# EAGLE design v1_TH (EAGLE 6.6.0)
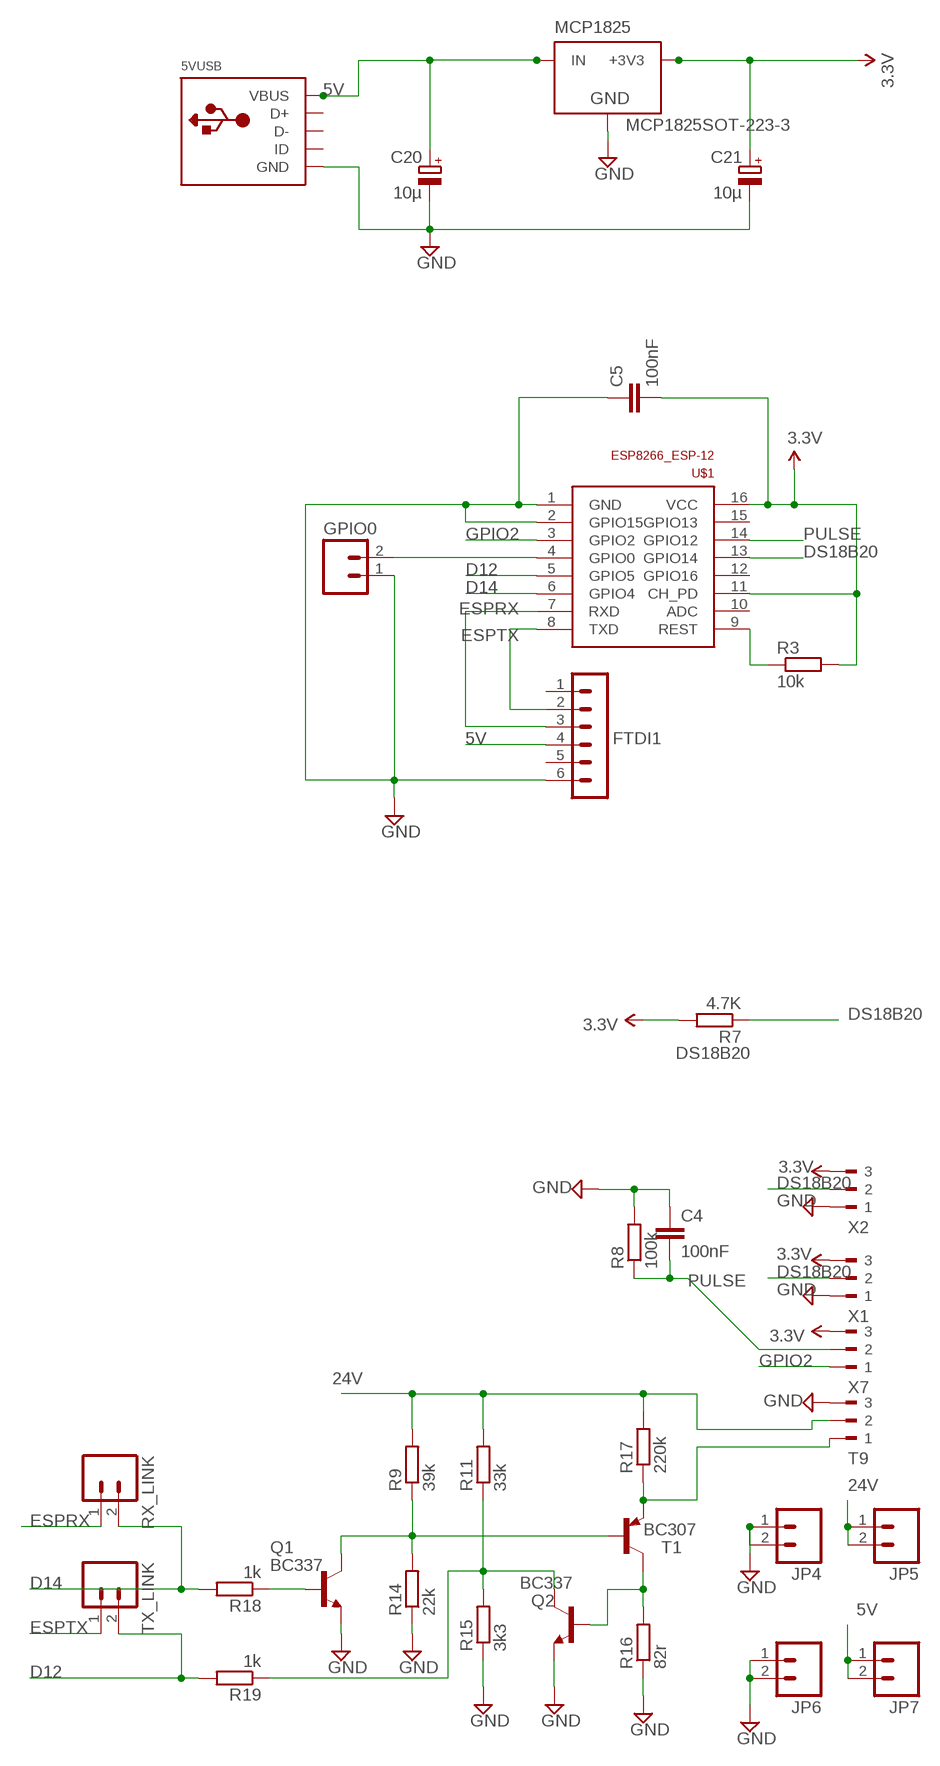
[diagram p0: schematic, sheet 1]

## Parts
5VUSB  USBMOLEX  [USB-MINIB-THM-MOLEX]
C4  100nF  C-EU025-024X044  [C025-024X044]
C5  100nF  C-EU025-024X044  [C025-024X044]
C20  10µ  CPOL-EUE1.8-4  [E1,8-4]
C21  10µ  CPOL-EUE1.8-4  [E1,8-4]
FTDI1  FTDI  MA06-1  [MA06-1]
GPIO0  M02PTH  [1X02]
JP4  M02PTH  [1X02]
JP5  M02PTH  [1X02]
JP6  M02PTH  [1X02]
JP7  M02PTH  [1X02]
MCP1825  MCP1825SOT-223-3  [SOT-223]
Q1  BC337  [TO92]
Q2  BC337  [TO92]
R3  10k  R-EU_0204/7  [0204/7]
R7  4.7K  R-EU_0204/7  [0204/7]
R8  100k  R-EU_0207/2V  [0207/2V]
R9  39k  R-EU_0204/7  [0204/7]
R11  33k  R-EU_0204/7  [0204/7]
R14  22k  R-EU_0204/7  [0204/7]
R15  3k3  R-EU_0204/7  [0204/7]
R16  82r  R-EU_0204/7  [0204/7]
R17  220k  R-EU_0204/7  [0204/7]
R18  1k  R-EU_0204/7  [0204/7]
R19  1k  R-EU_0204/7  [0204/7]
RX_LINK  M02PTH  [1X02]
T1  BC307  [TO92]
T9  180-3  [180-3]
TX_LINK  M02PTH  [1X02]
U$1  ESP8266_ESP-12  [ESP8266-ESP12]
X1  180-3  [180-3]
X2  180-3  [180-3]
X7  180-3  [180-3]

## Nets
3.3V: C5.2 C21.+ MCP1825.3(+3V3) R3.2 R7.2 U$1.11(CH_PD) U$1.16(VCC) X1.3 X2.3 X7.3
5V [power]: 5VUSB.VBUS C20.+ FTDI1.4 JP7.1 JP7.2 MCP1825.1(IN)
24V: JP5.1 JP5.2 R9.2 R11.2 R17.2 T9.2
D12: R19.2 TX_LINK.2 U$1.5(GPIO5)
D14: R18.2 RX_LINK.2 U$1.6(GPIO4)
DS18B20: R7.1 U$1.13(GPIO14) X1.2 X2.2
ESPRX: FTDI1.3 RX_LINK.1 U$1.7(RXD)
ESPTX: FTDI1.2 TX_LINK.1 U$1.8(TXD)
GND [power]: 5VUSB.GND C4.1 C5.1 C20.- C21.- FTDI1.6 GPIO0.1 JP4.1 JP4.2 JP6.1 JP6.2 MCP1825.2(GND) Q1.1(E) Q2.1(E) R8.2 R14.1 R15.1 R16.1 T9.3 U$1.1(GND) U$1.2(GPIO15) X1.1 X2.1
GPIO2: U$1.3(GPIO2) X7.1
N$13: R17.1 T1.1(E) T9.1
N$16: Q2.2(B) R16.2 T1.3(C)
N$18: Q1.3(C) R9.1 R14.2 T1.2(B)
N$21: Q2.3(C) R11.1 R15.2 R19.1
N$25: Q1.2(B) R18.1
N$29: GPIO0.2 U$1.4(GPIO0)
N$40: R3.1 U$1.9(REST)
PULSE: C4.2 R8.1 U$1.14(GPIO12) X7.2
Unconnected: 5VUSB.D+ 5VUSB.D- 5VUSB.ID FTDI1.1 FTDI1.5 U$1.10(ADC) U$1.12(GPIO16) U$1.15(GPIO13)

## Library data of the parts
5VUSB = adafruit:USB: USB Connectors USBMINIB - Surface Mount Female Mini-B USB Connector 4UConnector: 06564 By microbuilder.eu Thru-hole RA Female Mini-B USB Connector 4UConnector: 18732 By ladyada.net
C4 C5 = resistor:C-EU: CAPACITOR, European symbol
C20 C21 = resistor:CPOL-EU: POLARIZED CAPACITOR, European symbol
FTDI1 = JeeLabs:MA06-1: PIN HEADER
GPIO0 JP4-JP7 RX_LINK TX_LINK = SparkFun:M02: Header 2 Standard 2-pin 0.1" header. Use with straight break away headers (SKU : PRT-00116), right angle break away headers (PRT-00553), swiss pins (PRT-00743), machine pins (PRT-00117), and female headers (PRT-00115). Molex polarized connector foot print use with SKU : PRT-08233 with associated crimp pins and housings.
MCP1825 = SteelCaveRobotics-Power:MCP1825: MCP1825 3.3v LDO Linear Regulator
Q1 Q2 = transistor:BC337: NPN TRANSISTOR
R3 R8 = rcl:R-EU_: RESISTOR, European symbol
R7 R9 R11 R14-R19 = resistor:R-EU_: RESISTOR, European symbol
T1 = transistor-pnp:BC307: PNP Transistor
T9 X1 X2 X7 = con-weidmueller-sl35:180-3: WEIDMUELLER CLAMP CONNECTOR; OC_FARNELL: unknown; OC_NEWARK: unknown
U$1 = ESP8266-ESP12:ESP8266_ESP-12

## Net classes
0 default: width 0.203 mm, drill 0.6 mm, clearance 0.203 mm
1 power: width 0.381 mm, drill 0.6 mm, clearance 0.254 mm
2 gnd: width 0.254 mm, drill 0.6 mm, clearance 0.254 mm

## Board
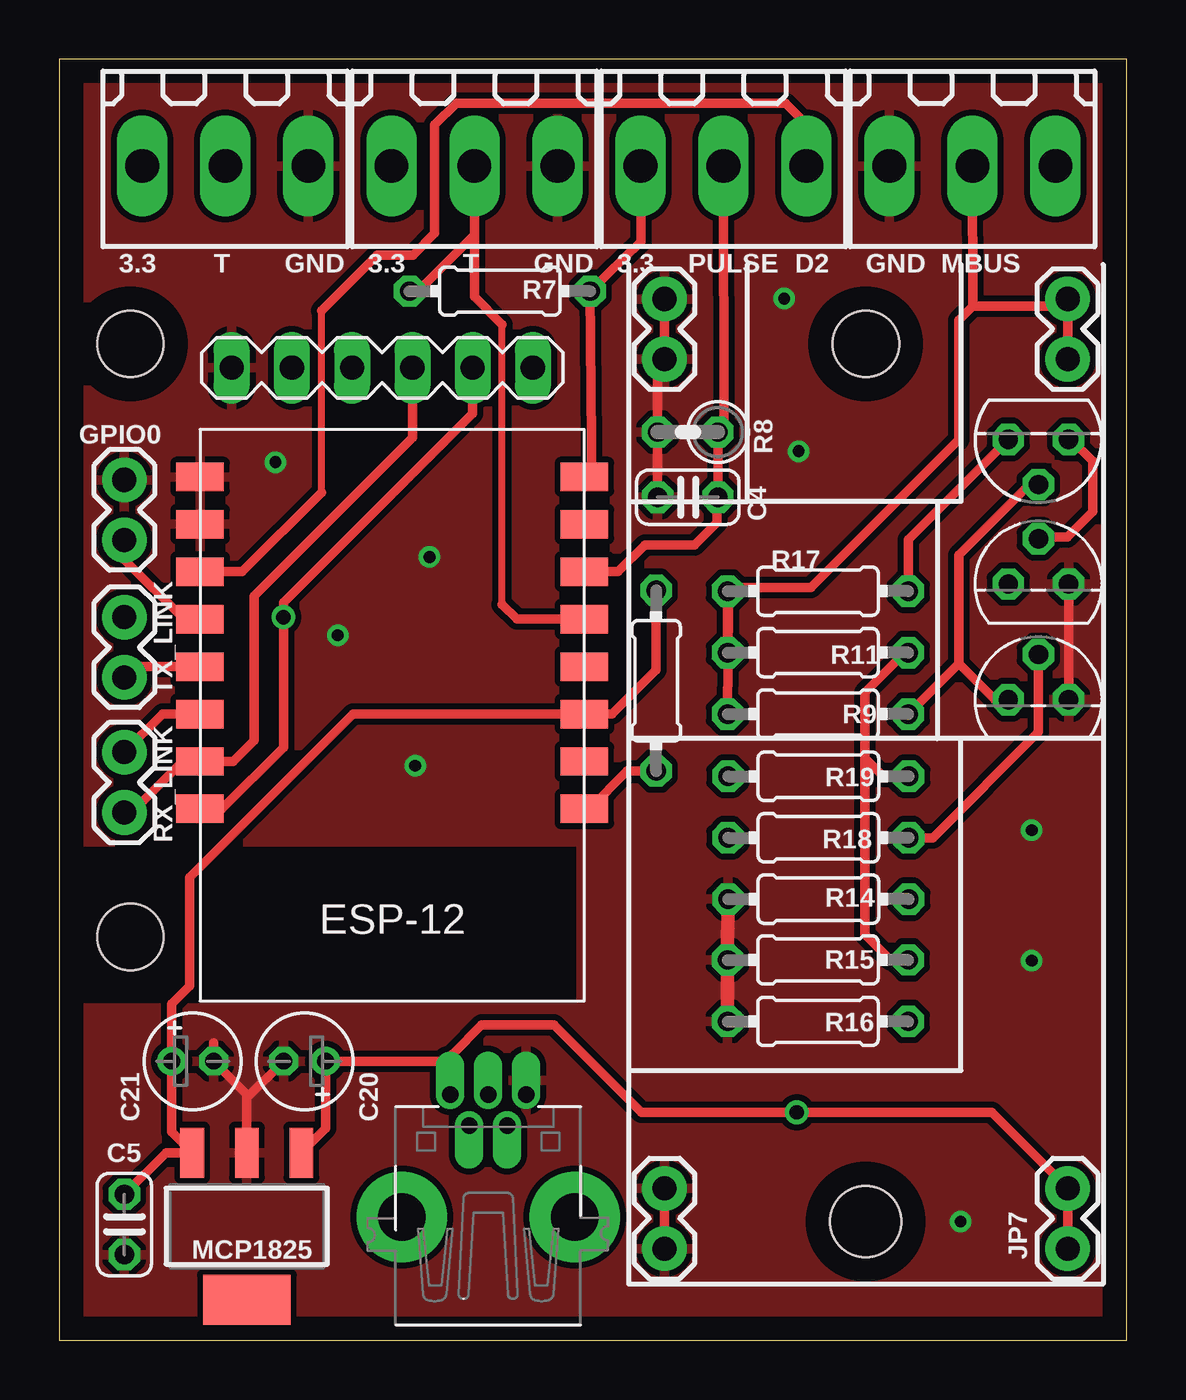
[diagram p1: board, top side]
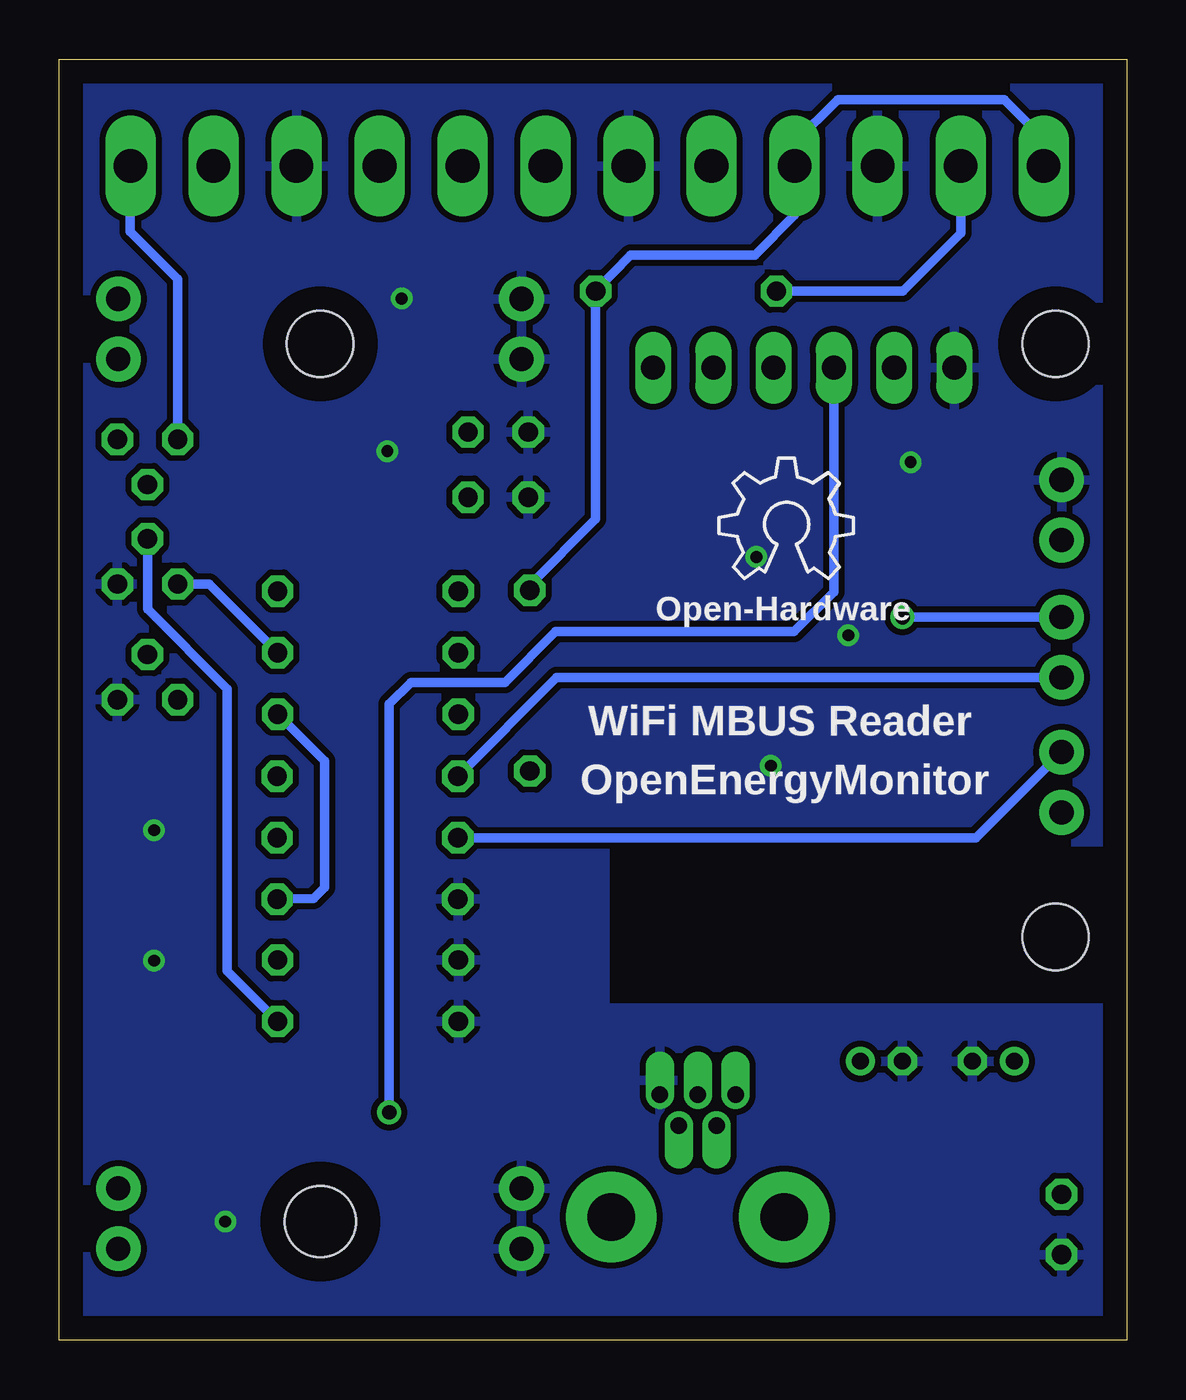
[diagram p2: board, bottom side, seen from below]

Size 45 x 54 mm. Coordinates in mm from the lower left corner, seen from the top.
Outline: 45,0 45,54 0,54 0,0 45,0
Copper layers (1*16): Top 0.035mm / dielectric 1.5mm / Bottom 0.035mm
Design rules "default *": minimum track width 10mil, minimum drill 24mil, track to track 8mil, track to pad 8mil, pad to pad 8mil, via to via 8mil, smd to smd 8mil, copper to edge 40mil, drill to drill 8mil, minimum pad ring 10mil, minimum via ring 8mil, stop-mask expansion 0.075mm, vias tented up to drill 0.6mm, thermal gap 10mil
Holes 2.8 mm at 3,42 34,42 3,17
Holes 3 mm at 34,5

### Footprints (pad centres in the part's own frame; a part is rotated, then mirrored left to right if it is on the bottom)
USB-MINIB-THM-MOLEX = drill 0.7 offset: D+ 0,9.72; D- -0.8,8.42; GND 1.6,9.72; ID 0.8,8.42; VBUS -1.6,9.72 | drill 2 pad 3.81: GND1 -3.65,4.57; GND4 3.65,4.57
C025-024X044 = drill 0.813 octagon: 1 -1.27,0; 2 1.27,0
E1,8-4 = drill 0.711 pad 1.168: + -0.889,0 | drill 0.711 pad 1.168 octagon: - 0.889,0
MA06-1 = drill 1.016 long: 1 0,0; 2 2.54,0; 3 5.08,0; 4 7.62,0; 5 10.16,0; 6 12.7,0
1X02 = drill 1.016 pad 1.88: 1 0,0; 2 2.54,0
SOT-223 = smd 1 x 2.1: 1 -2.3,-3.1; 2 0,-3.1; 3 2.3,-3.1 | smd 3.7 x 2.1: 4 0,3.1
TO92 = drill 0.813 octagon: 1 1.27,0; 2 0,1.905; 3 -1.27,0
0204/7 = drill 0.813 octagon: 1 -3.81,0; 2 3.81,0
0207/2V = drill 0.813 octagon: 1 -1.27,0; 2 1.27,0
180-3 = drill 1.422 long: 1 -3.5,0; 2 0,0; 3 3.5,0
ESP8266-ESP12 = smd 2 x 1.2: 1 16.2,2; 2 16.2,4; 3 16.2,6; 4 16.2,8; 5 16.2,10; 6 16.2,12; 7 16.2,14; 8 16.2,16; 9 0,16; 10 0,14; 11 0,12; 12 0,10; 13 0,8; 14 0,6; 15 0,4; 16 0,2

### Placement (x,y rotation side)
5VUSB  18.08,0.63 0 top
C4  26.5,35.54 0 top
C5  2.74,4.88 90 top
C20  10.34,11.76 180 top
C21  5.62,11.76 0 top
FTDI1  19.96,41 180 top
GPIO0  2.74,36.27 270 top
JP4  25.51,41.36 90 top
JP5  42.51,41.36 90 top
JP6  25.51,3.86 90 top
JP7  42.51,3.86 90 top
LOGO1  OSHW_LOGO_6MILX0200-NT  [OSHW_6X200_NOTEXT]  17.18,32.11 0 bottom
MCP1825  7.91,4.8 180 top
Q1  41.28,27 0 top
Q2  41.28,31.88 0 top
R3  25.16,27.8 90 top
R7  18.57,44.23 0 top
R8  26.5,38.28 180 top
R9  31.99,26.39 180 top
R11  31.99,28.99 180 top
R14  32,18.59 0 top
R15  31.99,16.03 0 top
R16  31.99,13.44 0 top
R17  31.99,31.58 180 top
R18  32,21.18 180 top
R19  32,23.77 180 top
RX_LINK  2.74,22.25 90 top
T1  41.28,37.98 180 top
T9  38.5,49.5 180 top
TX_LINK  2.74,30.48 270 top
U$1  22.13,38.4 180 top
X1  17.5,49.5 180 top
X2  7,49.5 180 top
X7  28,49.5 180 top

### Tracks (layer width: path | path; a pad name or v marks a point on that pad's centre or on a via)
3.3V
  Top 0.406: X7.3 24.52,46.31 R7.2 | 22.08,43.87 R7.2 | R7.2 22.43,37.92 22.43,36.7 arc-90 U$1.16 | R3.2 25.16,28.26 23.3,26.4 U$1.11 12.38,26.4 5.49,19.51 5.49,14.94 4.73,14.18 C21.+ 4.73,8.78 MCP1825.3 4.5,7.9 C5.2
  Bottom 0.406: X2.3 3.49,50.63 5.16,52.3 12.17,52.3 14,50.47 14,49.11 X1.3 14.01,47.42 15.68,45.75 20.91,45.75 R7.2 22.43,43.62 22.38,43.56 22.38,34.62 25.16,31.84 R3.2
5V  (via drill 0.6)
  Top 0.406: MCP1825.1 11.23,8.93 C20.+ 15.98,11.76 16.29,11.46 16.29,10.54 5VUSB.VBUS 16.59,10.46 16.59,12.07 17.81,13.29 20.86,13.29 24.55,9.6 v31.09,9.6 39.32,9.6 JP7.2 JP7.1
  Bottom 0.406: 11.09,11.91 C20.+ | v31.09,9.6 31.09,26.82 30.18,27.74 26.21,27.74 24.08,29.87 14.02,29.87 12.34,31.55 FTDI1.4
24V
  Top 0.406: R9.2 28.2,30.97 R11.2 R17.2 28.33,31.73 31.68,31.73 37.93,37.98 37.93,43.01 38.51,43.59 | JP5.1 JP5.2 42.2,43.59 38.51,43.59 | 38.51,43.59 T9.2
D12
  Top 0.406: TX_LINK.2 3.2,28.4 U$1.5
  Bottom 0.406: R19.2 24.03,27.94 TX_LINK.2
D14
  Top 0.406: RX_LINK.2 4.35,26.4 U$1.6
  Bottom 0.406: R18.2 6.35,21.18 RX_LINK.2
DS18B20
  Top 0.305: 18.67,31.02 18.67,42.82
  Top 0.406: X1.2 17.51,46.61 | U$1.13 19.3,30.4 18.67,31.02 | 17.51,46.61 15.12,44.23 R7.1 | 18.67,42.82 17.51,43.99 17.51,46.61
  Bottom 0.406: X2.2 6.99,46.66 9.43,44.23 R7.1
ESPRX
  Top 0.406: RX_LINK.1 3.05,22.25 5.2,24.4 U$1.7 7.33,24.4 8.21,25.28 8.21,31.38 14.88,38.05 FTDI1.3
ESPTX  (via drill 0.6)
  Top 0.406: U$1.8 6.85,22.4 9.45,24.99 v9.45,30.48 9.45,31.09 17.42,39.06 FTDI1.2
  Bottom 0.406: TX_LINK.1 v9.45,30.48
GND  (via drill 0.5)
  Top 0.406: JP4.1 25.48,41.33 | Q2.1 Q1.1 | C4.1 R8.2 25.23,41.08 JP4.1 | JP4.2 JP4.1 | C20.- 7.91,10.21 MCP1825.2 7.91,10.37 C21.- 6.51,12.53 | X2.1 10.49,48.18 | JP6.2 JP6.1
  Top 0.559: R16.1 R15.1 R14.1
  other vias: 41,16 30.56,43.91 15.61,33.02 15,24.22 38,5 31.17,37.48 11.73,29.72 9.11,37.02 41,21.5 41,16
  pour Bottom (isolate 0.254): 0,0 45,0 45,54 0,54 0,21 22,21 22,14 0,14
  pour Top (isolate 0.254): 0,21 22,21 22,14 0,14 0,0 45,0 45,54 0,54
GPIO2
  Top 0.305: 11.05,35.74 11.05,43.41
  Top 0.406: X7.1 31.52,51.24 30.61,52.15 16.75,52.15 15.83,51.24 15.83,46.66 14.92,45.75 13.39,45.75 11.05,43.41 | U$1.3 7.71,32.4 11.05,35.74
N$13
  Top 0.406: R17.1 35.8,33.76 T1.1
  Bottom 0.406: T9.1 42.01,46.73 40.01,44.73 T1.1
N$16
  Top 0.406: T1.3 42.65,37.98 43.57,37.06 43.57,34.93 42.5,33.86 41.36,33.86 Q2.2
  Bottom 0.406: Q2.2 41.28,30.81 37.93,27.46 37.93,15.57 R16.2
N$18
  Top 0.406: T1.2 40.9,36.07 37.93,33.1 37.93,28.53 | 37.93,28.53 R9.1 | Q1.3 39.45,27 37.93,28.53
  Bottom 0.406: R14.2 34.27,18.62 33.81,19.08 33.81,24.41 R9.1
N$21
  Top 0.406: R15.2 35.03,16.03 33.97,17.1 33.97,24.55 | R11.1 35.64,28.98 33.97,27.31 33.97,24.84 33.97,24.55 | R19.1 34.75,23.77 33.97,24.55
  Bottom 0.406: R11.1 38.69,31.88 Q2.3
N$25
  Top 0.406: Q1.2 41.28,25.63 36.83,21.18 R18.1
N$29
  Top 0.406: GPIO0.2 2.74,32.92 5.26,30.4 U$1.4 5.57,30.4
N$40
  Top 0.406: R3.1 23.94,24 22.35,22.4 U$1.9
PULSE
  Top 0.406: X7.2 28.02,38.54 R8.1 C4.2 27.72,35.49 27.72,34.47 26.77,33.53 24.69,33.53 23.56,32.4 U$1.14

### Text on the board
_tsilk: 3.3 | T | GND | 3.3 | T | GND | 3.3 | PULSE | D2 | GND MBUS
_bsilk: Open-Hardware | WiFi MBUS Reader | OpenEnergyMonitor